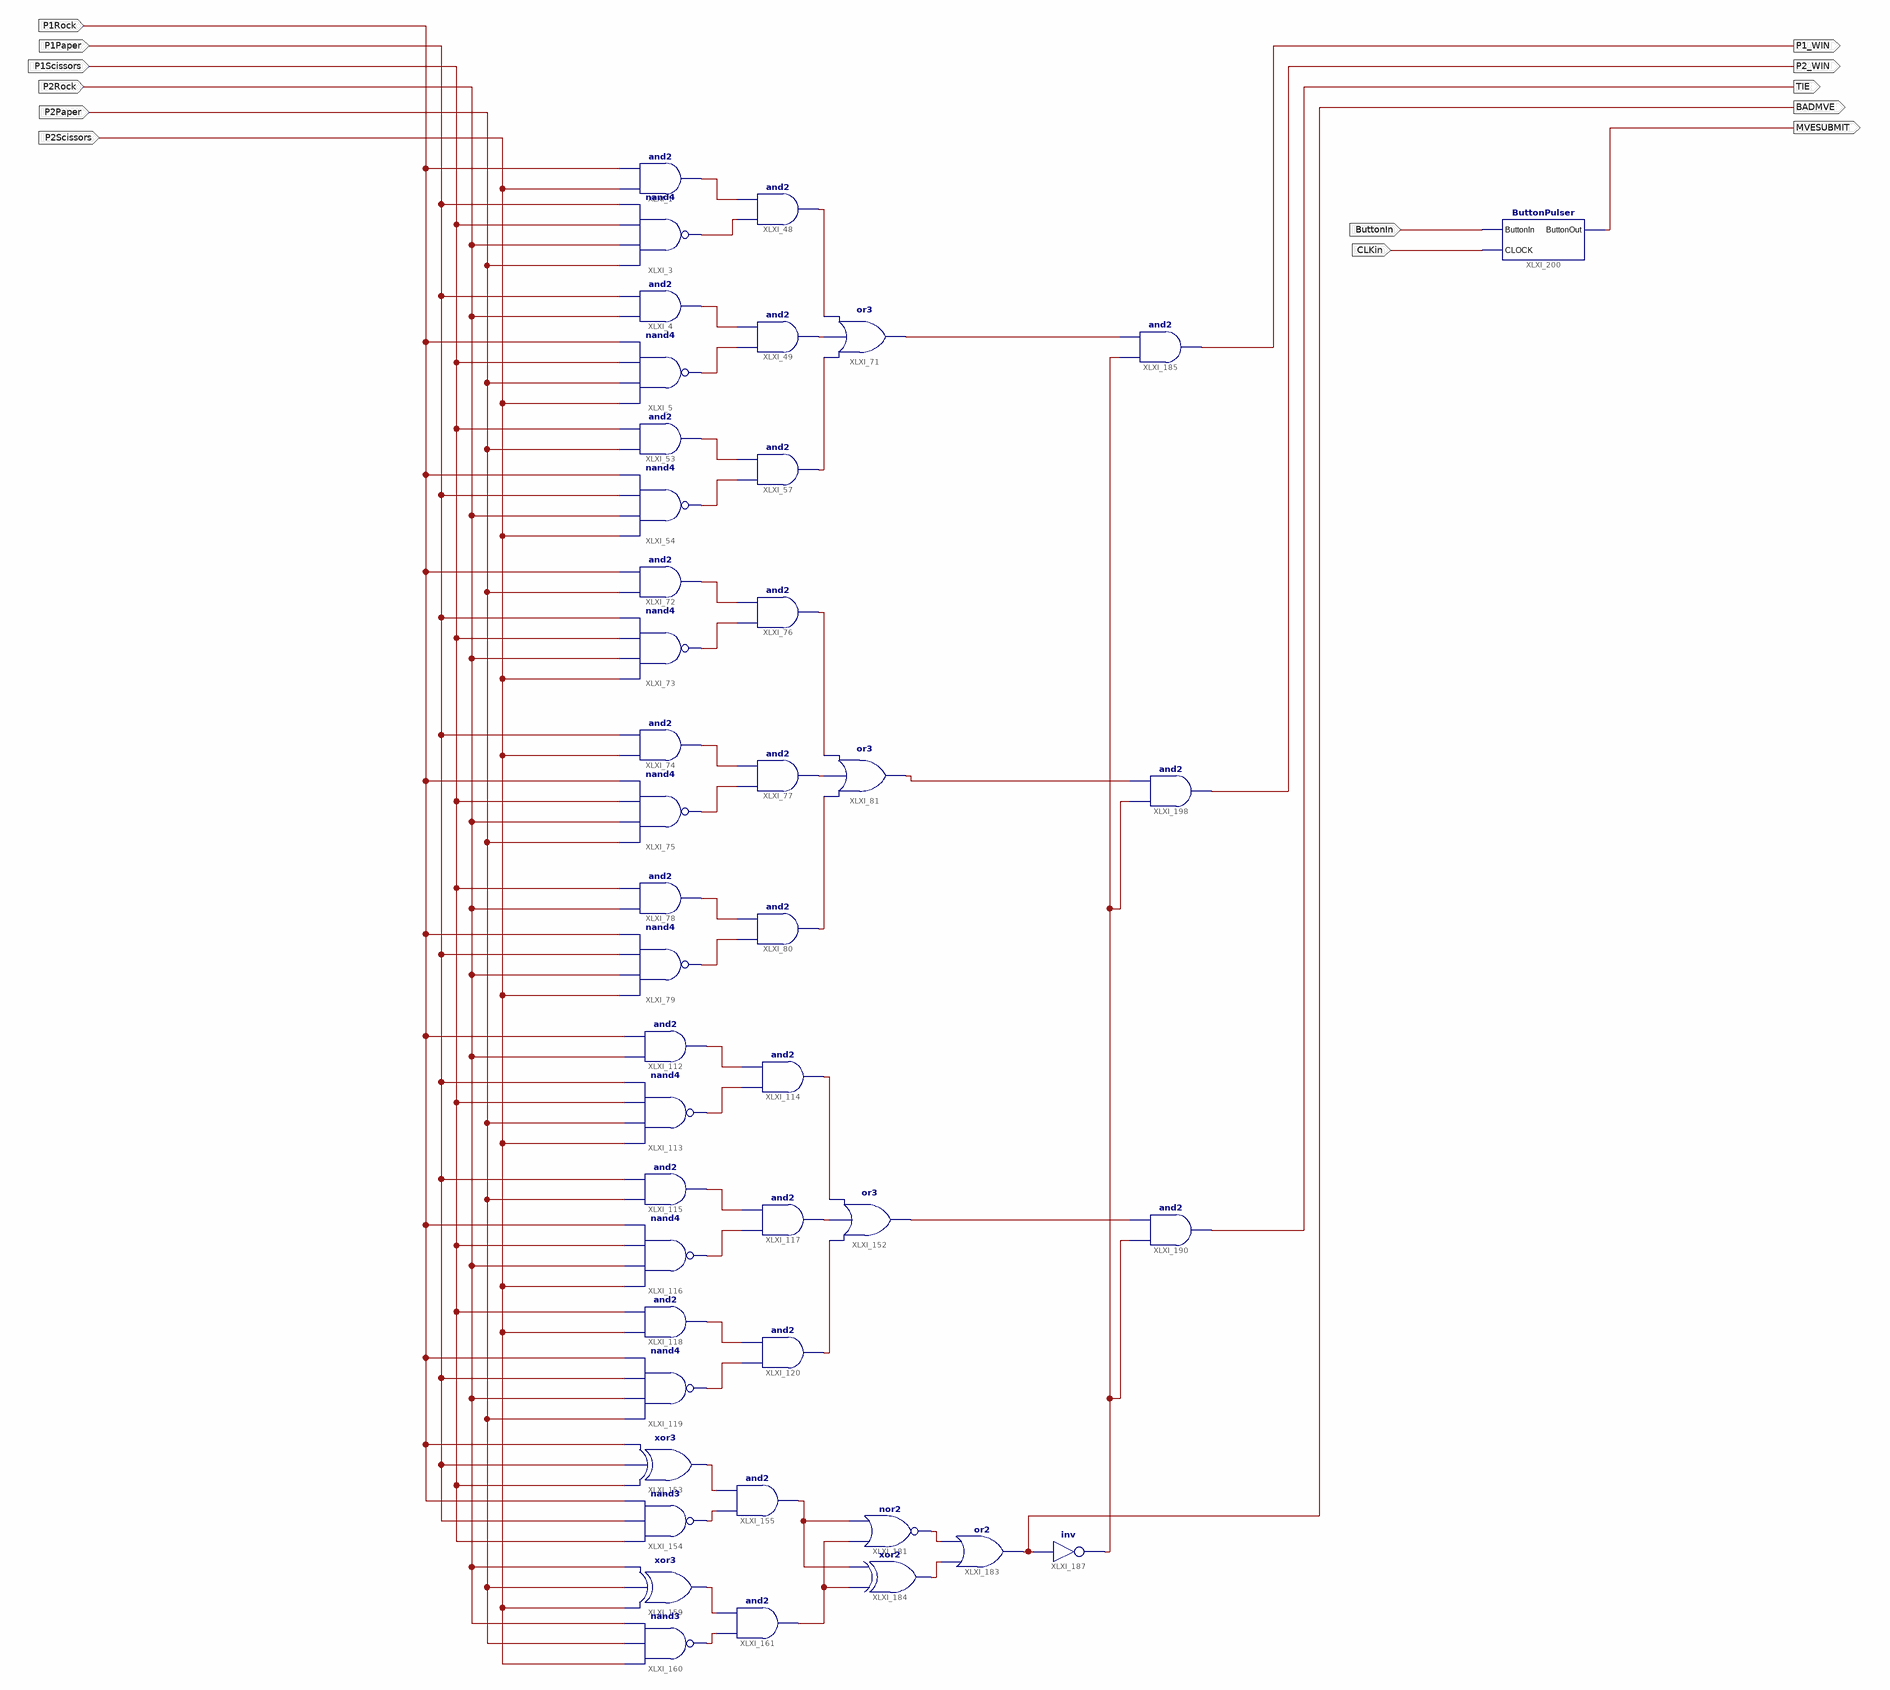
[diagram p0: schematic sheet 1]
// Xilinx ISE schematic GameInputs.sch (spartan6) as structural Verilog: 44 symbols, 13 ports
module GameInputs (
  input  P1Scissors,
  input  P1Paper,
  input  P1Rock,
  input  P2Rock,
  input  P2Paper,
  input  P2Scissors,
  input  CLKin,
  input  ButtonIn,
  output BADMVE,
  output P2_WIN,
  output P1_WIN,
  output TIE,
  output MVESUBMIT
);

  wire XLXN_64, XLXN_65, XLXN_66, XLXN_67, XLXN_74, XLXN_75, XLXN_86, XLXN_87, XLXN_88, XLXN_92, XLXN_93,
       XLXN_94, XLXN_95, XLXN_96, XLXN_97, XLXN_98, XLXN_99, XLXN_100, XLXN_129, XLXN_130, XLXN_131,
       XLXN_132, XLXN_133, XLXN_134, XLXN_163, XLXN_164, XLXN_165, XLXN_168, XLXN_170, XLXN_173, XLXN_174,
       XLXN_194, XLXN_198, XLXN_199, XLXN_200, XLXN_204, XLXN_205, XLXN_214, XLXN_215;

  and XLXI_1 (XLXN_64, P2Scissors, P1Rock);
  nand XLXI_3 (XLXN_65, P2Paper, P2Rock, P1Scissors, P1Paper);
  and XLXI_48 (XLXN_86, XLXN_65, XLXN_64);
  or XLXI_71 (XLXN_204, XLXN_88, XLXN_87, XLXN_86);
  and XLXI_4 (XLXN_66, P2Rock, P1Paper);
  nand XLXI_5 (XLXN_67, P2Scissors, P2Paper, P1Scissors, P1Rock);
  and XLXI_49 (XLXN_87, XLXN_67, XLXN_66);
  and XLXI_53 (XLXN_75, P2Paper, P1Scissors);
  nand XLXI_54 (XLXN_74, P2Scissors, P2Rock, P1Paper, P1Rock);
  and XLXI_57 (XLXN_88, XLXN_74, XLXN_75);
  and XLXI_72 (XLXN_93, P2Paper, P1Rock);
  nand XLXI_73 (XLXN_92, P2Scissors, P2Rock, P1Scissors, P1Paper);
  and XLXI_74 (XLXN_94, P2Scissors, P1Paper);
  nand XLXI_75 (XLXN_95, P2Paper, P2Rock, P1Scissors, P1Rock);
  and XLXI_76 (XLXN_98, XLXN_92, XLXN_93);
  and XLXI_77 (XLXN_99, XLXN_95, XLXN_94);
  and XLXI_78 (XLXN_97, P2Rock, P1Scissors);
  nand XLXI_79 (XLXN_96, P2Scissors, P2Rock, P1Paper, P1Rock);
  and XLXI_80 (XLXN_100, XLXN_96, XLXN_97);
  or XLXI_81 (XLXN_205, XLXN_100, XLXN_99, XLXN_98);
  and XLXI_112 (XLXN_129, P2Rock, P1Rock);
  nand XLXI_113 (XLXN_130, P2Scissors, P2Paper, P1Scissors, P1Paper);
  and XLXI_114 (XLXN_163, XLXN_130, XLXN_129);
  and XLXI_115 (XLXN_131, P2Paper, P1Paper);
  nand XLXI_116 (XLXN_132, P2Scissors, P2Rock, P1Scissors, P1Rock);
  and XLXI_117 (XLXN_164, XLXN_132, XLXN_131);
  and XLXI_118 (XLXN_133, P2Scissors, P1Scissors);
  nand XLXI_119 (XLXN_134, P2Paper, P2Rock, P1Paper, P1Rock);
  and XLXI_120 (XLXN_165, XLXN_134, XLXN_133);
  or XLXI_152 (XLXN_214, XLXN_165, XLXN_164, XLXN_163);
  xor XLXI_153 (XLXN_168, P1Scissors, P1Paper, P1Rock);
  nand XLXI_154 (XLXN_170, P1Scissors, P1Paper, P1Rock);
  and XLXI_155 (XLXN_194, XLXN_170, XLXN_168);
  xor XLXI_159 (XLXN_173, P2Scissors, P2Paper, P2Rock);
  nand XLXI_160 (XLXN_174, P2Scissors, P2Paper, P2Rock);
  and XLXI_161 (XLXN_198, XLXN_174, XLXN_173);
  nor XLXI_181 (XLXN_199, XLXN_198, XLXN_194);
  or XLXI_183 (BADMVE, XLXN_200, XLXN_199);
  xor XLXI_184 (XLXN_200, XLXN_198, XLXN_194);
  and XLXI_185 (P1_WIN, XLXN_215, XLXN_204);
  not XLXI_187 (XLXN_215, BADMVE);
  and XLXI_190 (TIE, XLXN_215, XLXN_214);
  and XLXI_198 (P2_WIN, XLXN_215, XLXN_205);
  ButtonPulser XLXI_200 (.ButtonIn(ButtonIn), .CLOCK(CLKin), .ButtonOut(MVESUBMIT));
endmodule
